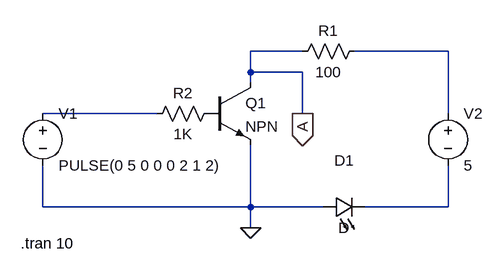
[diagram p0: schematic BJT_switchVSinverter.asc]
BJT_switchVSinverter.asc, the LTspice schematic file:
Version 4
SHEET 1 880 680
WIRE 272 48 192 48
WIRE 496 48 352 48
WIRE 192 80 192 48
WIRE 272 80 192 80
WIRE 192 96 192 80
WIRE 48 144 -128 144
WIRE 272 144 272 80
WIRE 496 144 496 48
WIRE -128 288 -128 224
WIRE 192 288 192 192
WIRE 192 288 -128 288
WIRE 304 288 192 288
WIRE 496 288 496 224
WIRE 496 288 368 288
WIRE 192 320 192 288
FLAG 192 320 0
FLAG 272 144 A
IOPIN 272 144 Out
SYMBOL voltage -128 128 R0
WINDOW 123 24 124 Left 2
WINDOW 39 0 0 Left 0
SYMATTR InstName V1
SYMATTR Value PULSE(0 5 0 0 0 2 1 2)
SYMBOL voltage 496 128 R0
WINDOW 123 0 0 Left 0
WINDOW 39 0 0 Left 0
SYMATTR InstName V2
SYMATTR Value 5
SYMBOL res 368 32 R90
WINDOW 0 0 56 VBottom 2
WINDOW 3 32 56 VTop 2
SYMATTR InstName R1
SYMATTR Value 100
SYMBOL npn 128 96 R0
SYMATTR InstName Q1
SYMBOL res 144 128 R90
WINDOW 0 0 56 VBottom 2
WINDOW 3 32 56 VTop 2
SYMATTR InstName R2
SYMATTR Value 1K
SYMBOL LED 304 304 R270
WINDOW 0 72 32 VTop 2
WINDOW 3 0 32 VBottom 2
SYMATTR InstName D1
TEXT -162 344 Left 2 !.tran 10

The netlist it stands for:
* BJT_switchVSinverter.asc
V1 N002 0 PULSE(0 5 0 0 0 2 1 2)
V2 N001 N003 5
R1 N001 A 100
Q1 A P001 0 0 NPN
R2 P001 N002 1K
D1 0 N003 D
.model D D
.lib standard.dio
.model NPN NPN
.model PNP PNP
.lib standard.bjt
.tran 10
.backanno
.end